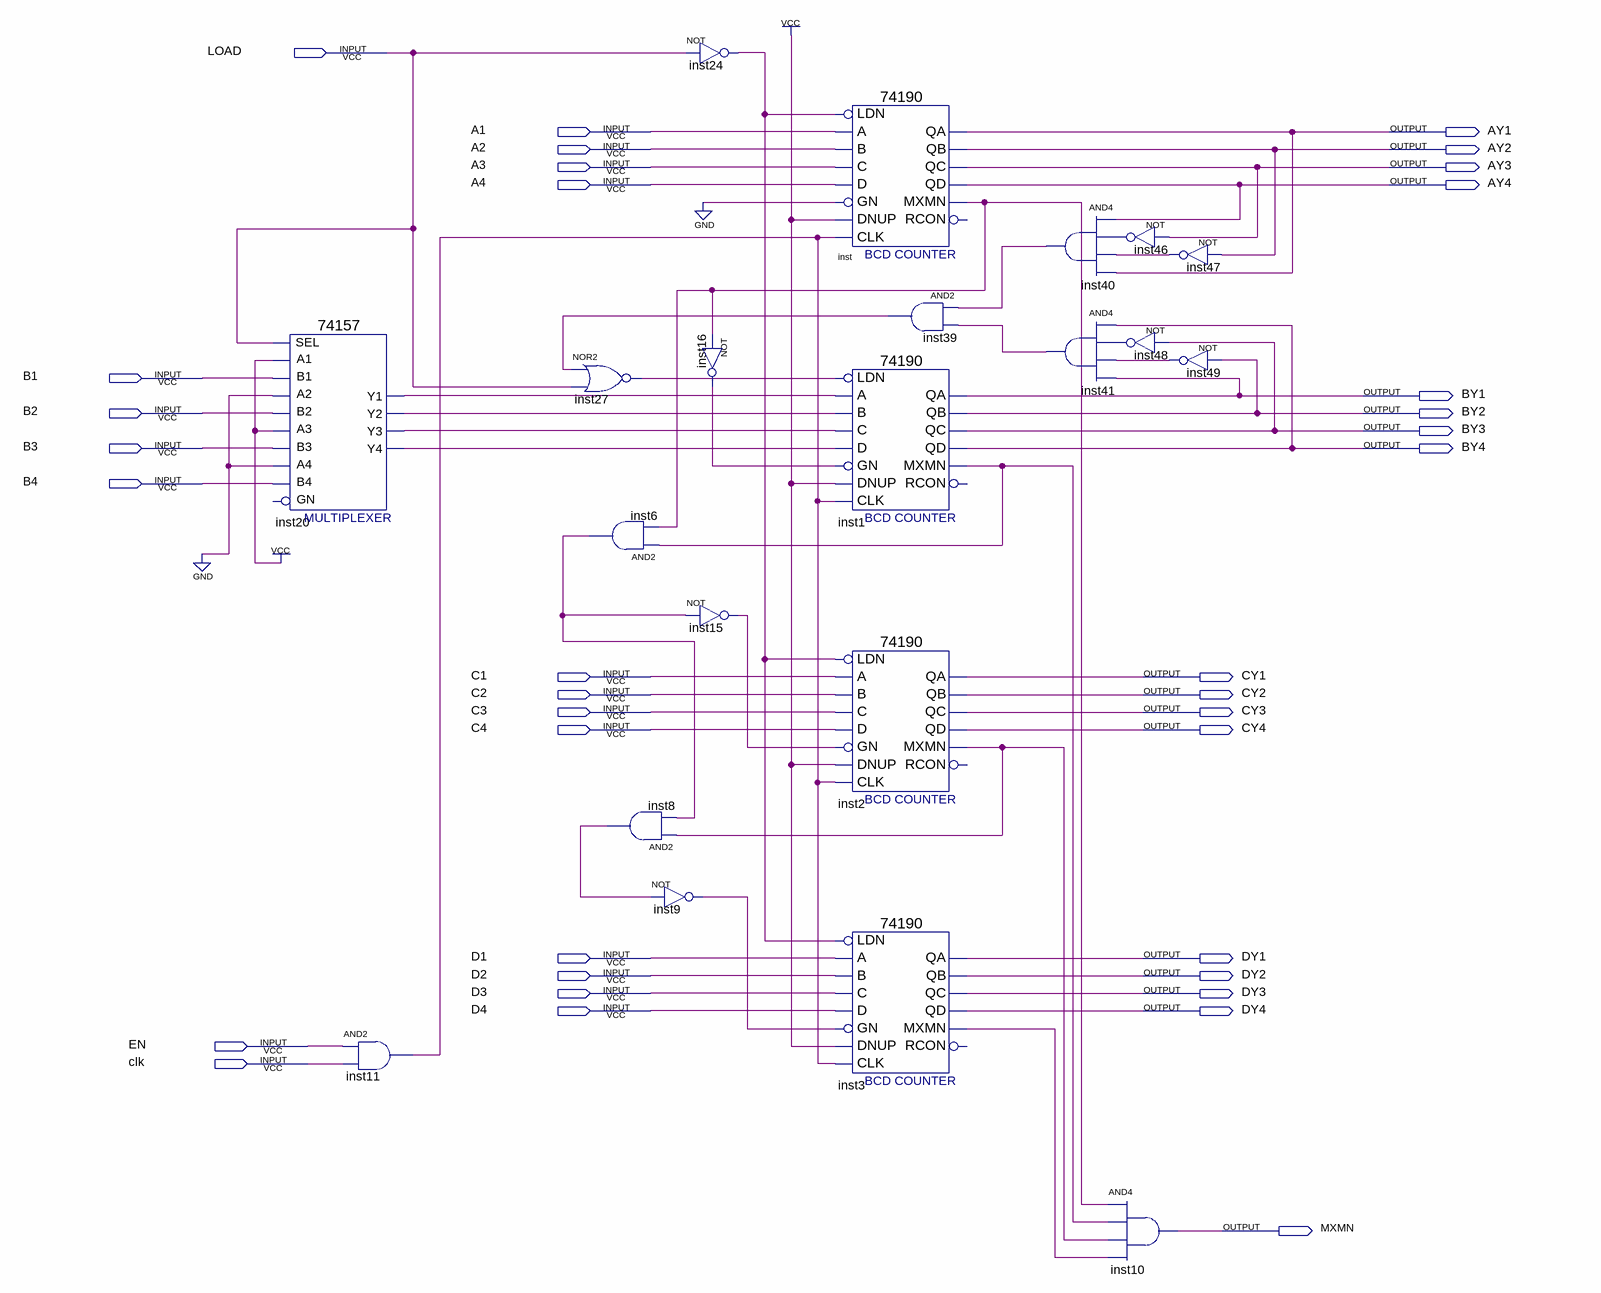
[diagram p0: schematic sheet]
// Quartus schematic contadores.bdf as structural Verilog: 21 symbols, 36 pins
module contadores (
  input  LOAD,
  input  A1,
  input  A2,
  input  A3,
  input  A4,
  input  B1,
  input  B2,
  input  B3,
  input  B4,
  input  C1,
  input  C2,
  input  C3,
  input  C4,
  input  D1,
  input  D2,
  input  D3,
  input  D4,
  input  EN,
  input  clk,
  output AY1,
  output AY2,
  output AY3,
  output AY4,
  output BY1,
  output BY2,
  output BY3,
  output BY4,
  output CY1,
  output CY2,
  output CY3,
  output CY4,
  output DY1,
  output DY2,
  output DY3,
  output DY4,
  output MXMN
);

  wire inst1_mxmn, inst2_mxmn, inst3_mxmn, inst6_out, inst8_out, inst9_out, inst11_out, inst15_out,
       inst16_out, inst20_y1, inst20_y2, inst20_y3, inst20_y4, inst24_out, inst27_out, inst39_out,
       inst40_out, inst41_out, inst46_out, inst47_out, inst48_out, inst49_out, inst_mxmn;

  \74157  inst20 (
    .A1(1'b1), .B1(B1), .SEL(LOAD), .B2(B2), .A3(1'b1), .B3(B3), .A2(1'b0), .B4(B4), .A4(1'b0),
    .Y2(inst20_y2), .Y1(inst20_y1), .Y4(inst20_y4), .Y3(inst20_y3));  // open: GN
  and inst11 (inst11_out, EN, clk);
  nor inst27 (inst27_out, inst39_out, LOAD);
  and inst6 (inst6_out, inst1_mxmn, inst_mxmn);
  and inst8 (inst8_out, inst2_mxmn, inst6_out);
  not inst9 (inst9_out, inst8_out);
  not inst24 (inst24_out, LOAD);
  not inst16 (inst16_out, inst_mxmn);
  not inst15 (inst15_out, inst6_out);
  \74190  inst (
    .LDN(inst24_out), .A(A1), .C(A3), .B(A2), .D(A4), .GN(1'b0), .CLK(inst11_out), .DNUP(1'b1), .QA(AY1),
    .QB(AY2), .QD(AY4), .QC(AY3), .MXMN(inst_mxmn));  // open: RCON
  \74190  inst1 (
    .LDN(inst27_out), .A(inst20_y1), .C(inst20_y3), .B(inst20_y2), .D(inst20_y4), .GN(inst16_out),
    .CLK(inst11_out), .DNUP(1'b1), .QA(BY1), .QB(BY2), .QD(BY4), .QC(BY3), .MXMN(inst1_mxmn));  // open: RCON
  \74190  inst2 (
    .LDN(inst24_out), .A(C1), .C(C3), .B(C2), .D(C4), .GN(inst15_out), .CLK(inst11_out), .DNUP(1'b1),
    .QA(CY1), .QB(CY2), .QD(CY4), .QC(CY3), .MXMN(inst2_mxmn));  // open: RCON
  \74190  inst3 (
    .LDN(inst24_out), .A(D1), .C(D3), .B(D2), .D(D4), .GN(inst9_out), .CLK(inst11_out), .DNUP(1'b1),
    .QA(DY1), .QB(DY2), .QD(DY4), .QC(DY3), .MXMN(inst3_mxmn));  // open: RCON
  and inst39 (inst39_out, inst40_out, inst41_out);
  and inst40 (inst40_out, AY4, inst46_out, inst47_out, AY1);
  and inst41 (inst41_out, BY4, inst48_out, inst49_out, BY1);
  not inst46 (inst46_out, AY3);
  not inst48 (inst48_out, BY3);
  and inst10 (MXMN, inst_mxmn, inst1_mxmn, inst2_mxmn, inst3_mxmn);
  not inst47 (inst47_out, AY2);
  not inst49 (inst49_out, BY2);
endmodule
